# Altium schematic sheet 06 - MCU.SchDoc
size 420 x 297 mm
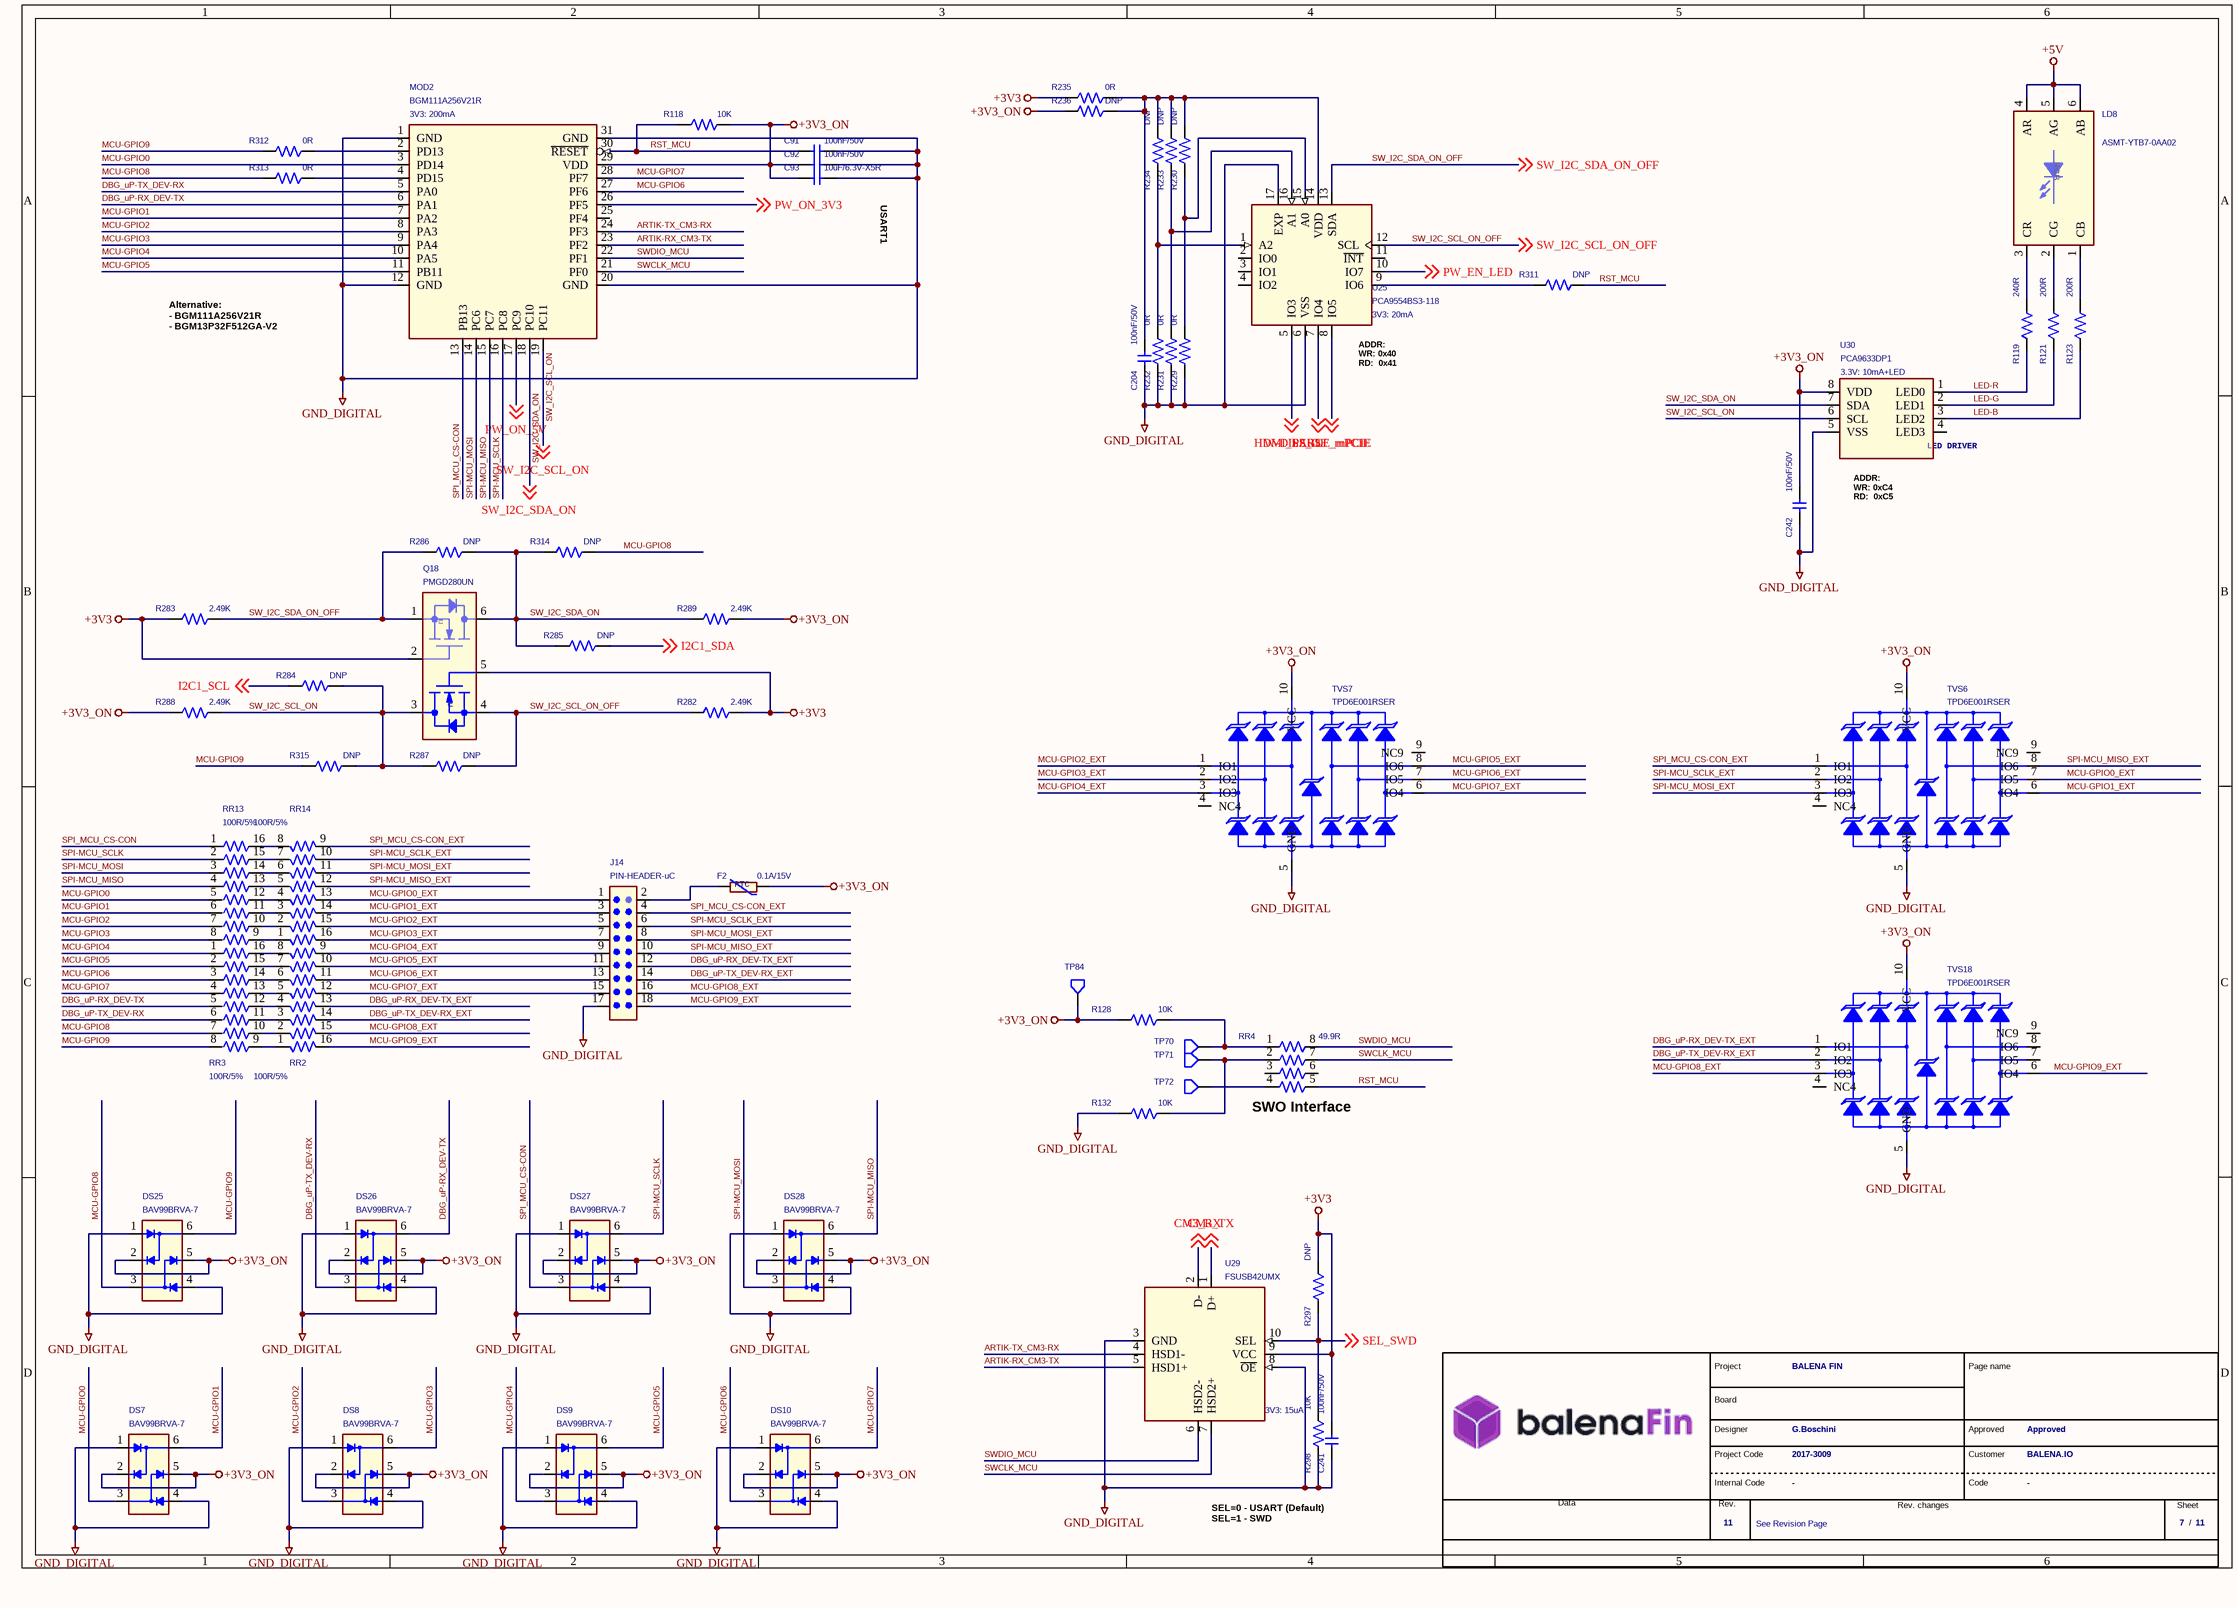
[diagram p0: 06 - MCU.SchDoc]

## Parts
*  Revision: 11  FAE RD code: 2017-3009  DocumentoRev: See Revision Page  Page Number: 7  Nome Progetto: BALENA FIN  Customer name: BALENA.IO  Project manager: Approved  Project designer: G.Boschini  (hidden comment: MyFAEVuoto)  (graphical)
C91  100nF/50V  [CS-C-0402]
C92  100nF/50V  [CS-C-0402]
C93  10uF/6.3V-X5R  [CS-C-0402]
C204  100nF/50V  [CS-C-0402]
C241  100nF/50V  [CS-C-0402]
C242  100nF/50V  [CS-C-0402]
DS7  BAV99BRVA-7  [SOT563]
DS8  BAV99BRVA-7  [SOT563]
DS9  BAV99BRVA-7  [SOT563]
DS10  BAV99BRVA-7  [SOT563]
DS25  BAV99BRVA-7  [SOT563]
DS26  BAV99BRVA-7  [SOT563]
DS27  BAV99BRVA-7  [SOT563]
DS28  BAV99BRVA-7  [SOT563]
F2  0.1A/15V  [FS-0603]
J14  PIN-HEADER-uC  [J-9X2-0254-MDT]
LD8  ASMT-YTB7-0AA02  [LD-PLCC6-GUIDAVLP]
MOD2  BGM111A256V21R  Power requirements: 3V3: 200mA  [MOD-ARTIK-020]
Q18  PMGD280UN  [SOT363]
R118  10K  [RS-0402]
R119  240R  [RS-0402]
R121  200R  [RS-0402]
R123  200R  [RS-0402]
R128  10K  [RS-0402]
R132  10K  [RS-0402]
R229  0R  [RS-0402]
R230  DNP  [RS-0402]
R231  0R  [RS-0402]
R232  0R  [RS-0402]
R233  DNP  [RS-0402]
R234  DNP  [RS-0402]
R235  0R  [RS-0402]
R236  DNP  [RS-0402]
R282  2.49K  [RS-0402]
R283  2.49K  [RS-0402]
R284  DNP  [RS-0402]
R285  DNP  [RS-0402]
R286  DNP  [RS-0402]
R287  DNP  [RS-0402]
R288  2.49K  [RS-0402]
R289  2.49K  [RS-0402]
R297  DNP  [RS-0402]
R298  10K  [RS-0402]
R311  DNP  [RS-0402]
R312  0R  [RS-0402]
R313  0R  [RS-0402]
R314  DNP  [RS-0402]
R315  DNP  [RS-0402]
RR2  100R/5%  [RR-8X-1506]
RR3  100R/5%  [RR-8X-1506]
RR4  49.9R  [RR-1206]
RR13  100R/5%  [RR-8X-1506]
RR14  100R/5%  [RR-8X-1506]
TP70  TPS  [TPS-0100]  (value not drawn)  (no BOM)
TP71  TPS  [TPS-0100]  (value not drawn)  (no BOM)
TP72  TPS  [TPS-0100]  (value not drawn)  (no BOM)
TP84  TPS  [TPS-0100]  (value not drawn)  (no BOM)
TVS6  TPD6E001RSER  [UFQFN10]
TVS7  TPD6E001RSER  [UFQFN10]
TVS18  TPD6E001RSER  [UFQFN10]
U25  PCA9554BS3-118  Power requirements: 3V3: 20mA  [QFN16-EXP-3X3-4X4]
U29  FSUSB42UMX  Power requirements: 3V3: 15uA  [UMLP10]
U30  PCA9633DP1  Power requirements: 3.3V: 10mA+LED  [MSOP8]

## Nets
+3V3: C241.1 Q18.2(G1) Q18.5(G2) R235.2 R282.1 R283.2 R297.2 U29.9(VCC)
+3V3_ON: C92.1 C93.1 C242.1 DS7.2(C1) DS7.5(C2) DS8.2(C1) DS8.5(C2) DS9.2(C1) DS9.5(C2) DS10.2(C1) DS10.5(C2) DS25.2(C1) DS25.5(C2) DS26.2(C1) DS26.5(C2) DS27.2(C1) DS27.5(C2) DS28.2(C1) DS28.5(C2) F2.2 MOD2.29(VDD) R118.2 R128.2 R236.2 R288.2 R289.1 TP84.1(TP) TVS6.10(VCC) TVS7.10(VCC) TVS18.10(VCC) U30.8(VDD)
+5V: LD8.4(AR) LD8.5(AG) LD8.6(AB)
GND_DIGITAL: C91.2 C92.2 C93.2 C204.2 C241.2 C242.2 DS7.1(A1) DS7.4(A2) DS8.1(A1) DS8.4(A2) DS9.1(A1) DS9.4(A2) DS10.1(A1) DS10.4(A2) DS25.1(A1) DS25.4(A2) DS26.1(A1) DS26.4(A2) DS27.1(A1) DS27.4(A2) DS28.1(A1) DS28.4(A2) J14.17 MOD2.1(GND) MOD2.12(GND) MOD2.20(GND) MOD2.31(GND) R132.2 R229.1 R231.1 R232.1 R298.1 TVS6.5(GND) TVS7.5(GND) TVS18.5(GND) U25.6(VSS) U25.17(EXP) U29.3(GND) U29.8(~{OE}) U30.5(VSS)
ARTIK-RX_CM3-TX: MOD2.23(PF2) U29.5(HSD1+)
ARTIK-TX_CM3-RX: MOD2.24(PF3) U29.4(HSD1-)
CM3_RX: U29.2(D-) ; off-sheet CM3_RX
CM3_TX: U29.1(D+) ; off-sheet CM3_TX
DBG_uP-RX_DEV-TX: DS26.6(AC1) MOD2.6(PA1) RR3.5
DBG_uP-RX_DEV-TX_EXT: J14.12 RR2.13 TVS18.1(IO1)
DBG_uP-TX_DEV-RX: DS26.3(AC2) MOD2.5(PA0) RR3.6
DBG_uP-TX_DEV-RX_EXT: J14.14 RR2.14 TVS18.2(IO2)
HDMI_LS_OE: U25.5(IO3) ; off-sheet HDMI_LS_OE
I2C1_SCL: R284.2 ; off-sheet I2C1_SCL
I2C1_SDA: R285.1 ; off-sheet I2C1_SDA
LED-B: R123.2 U30.3(LED2)
LED-G: R121.2 U30.2(LED1)
LED-R: R119.2 U30.1(LED0)
MCU-GPIO0: DS7.3(AC2) MOD2.3(PD14) RR13.5
MCU-GPIO0_EXT: J14.1 RR14.13 TVS6.7(IO5)
MCU-GPIO1: DS7.6(AC1) MOD2.7(PA2) RR13.6
MCU-GPIO1_EXT: J14.3 RR14.14 TVS6.6(IO4)
MCU-GPIO2: DS8.3(AC2) MOD2.8(PA3) RR13.7
MCU-GPIO2_EXT: J14.5 RR14.15 TVS7.1(IO1)
MCU-GPIO3: DS8.6(AC1) MOD2.9(PA4) RR13.8
MCU-GPIO3_EXT: J14.7 RR14.16 TVS7.2(IO2)
MCU-GPIO4: DS9.3(AC2) MOD2.10(PA5) RR3.1
MCU-GPIO4_EXT: J14.9 RR2.9 TVS7.3(IO3)
MCU-GPIO5: DS9.6(AC1) MOD2.11(PB11) RR3.2
MCU-GPIO5_EXT: J14.11 RR2.10 TVS7.8(IO6)
MCU-GPIO6: DS10.3(AC2) MOD2.27(PF6) RR3.3
MCU-GPIO6_EXT: J14.13 RR2.11 TVS7.7(IO5)
MCU-GPIO7: DS10.6(AC1) MOD2.28(PF7) RR3.4
MCU-GPIO7_EXT: J14.15 RR2.12 TVS7.6(IO4)
MCU-GPIO8: DS25.3(AC2) R313.2 R314.1 RR3.7
MCU-GPIO8_EXT: J14.16 RR2.15 TVS18.3(IO3)
MCU-GPIO9: DS25.6(AC1) R312.2 R315.2 RR3.8
MCU-GPIO9_EXT: J14.18 RR2.16 TVS18.6(IO4)
PERST_mPCIE: U25.8(IO5) ; off-sheet PERST_mPCIE
PW_EN_LED: U25.10(IO7) ; off-sheet PW_EN_LED
PW_ON_3V3: MOD2.26(PF5) ; off-sheet PW_ON_3V3
PW_ON_5V: MOD2.17(PC9) ; off-sheet PW_ON_5V
RST_MCU: C91.1 MOD2.30(~{RESET}) R118.1 R311.1 RR4.5
SEL_SWD: R297.1 R298.2 U29.10(SEL) ; off-sheet SEL_SWD
SPI-MCU_MISO: DS28.6(AC1) MOD2.15(PC7) RR13.4
SPI-MCU_MISO_EXT: J14.10 RR14.12 TVS6.8(IO6)
SPI-MCU_MOSI: DS28.3(AC2) MOD2.14(PC6) RR13.3
SPI-MCU_MOSI_EXT: J14.8 RR14.11 TVS6.3(IO3)
SPI-MCU_SCLK: DS27.6(AC1) MOD2.16(PC8) RR13.2
SPI-MCU_SCLK_EXT: J14.6 RR14.10 TVS6.2(IO2)
SPI_MCU_CS-CON: DS27.3(AC2) MOD2.13(PB13) RR13.1
SPI_MCU_CS-CON_EXT: J14.4 RR14.9 TVS6.1(IO1)
SW_I2C_SCL_ON: MOD2.19(PC11) Q18.3(D2) R284.1 R287.2 R288.1 R315.1 U30.6(SCL) ; off-sheet SW_I2C_SCL_ON
SW_I2C_SCL_ON_OFF: Q18.4(S2) R282.2 R287.1 U25.12(SCL) ; off-sheet SW_I2C_SCL_ON_OFF
SW_I2C_SDA_ON: MOD2.18(PC10) Q18.6(D1) R285.2 R286.1 R289.2 R314.2 U30.7(SDA) ; off-sheet SW_I2C_SDA_ON
SW_I2C_SDA_ON_OFF: Q18.1(S1) R283.1 R286.2 U25.13(SDA) ; off-sheet SW_I2C_SDA_ON_OFF
SWCLK_MCU: MOD2.21(PF0) RR4.7 U29.7(HSD2+)
SWDIO_MCU: MOD2.22(PF1) RR4.8 U29.6(HSD2-)
W-DISABLE_mPCIE: U25.7(IO4) ; off-sheet W-DISABLE_mPCIE
NetC204_1: C204.1 R230.2 R233.2 R234.2 R235.1 R236.1 U25.14(VDD)
NetF2_1: F2.1 J14.2
NetLD8_1: LD8.1(CB) R123.1
NetLD8_2: LD8.2(CG) R121.1
NetLD8_3: LD8.3(CR) R119.1
NetMOD2_2: MOD2.2(PD13) R312.1
NetMOD2_4: MOD2.4(PD15) R313.1
NetR128_1: R128.1 RR4.1 TP70.1(TP)
NetR132_1: R132.1 RR4.2 TP71.1(TP)
NetR229_2: R229.2 R230.1 U25.15(A0)
NetR231_2: R231.2 R233.1 U25.16(A1)
NetR232_2: R232.2 R234.1 U25.1(A2)
NetR311_2: R311.2 U25.9(IO6)
NetRR2_1: RR2.1 RR3.9
NetRR2_2: RR2.2 RR3.10
NetRR2_3: RR2.3 RR3.11
NetRR2_4: RR2.4 RR3.12
NetRR2_5: RR2.5 RR3.13
NetRR2_6: RR2.6 RR3.14
NetRR2_7: RR2.7 RR3.15
NetRR2_8: RR2.8 RR3.16
NetRR4_4: RR4.4 TP72.1(TP)
NetRR13_9: RR13.9 RR14.1
NetRR13_10: RR13.10 RR14.2
NetRR13_11: RR13.11 RR14.3
NetRR13_12: RR13.12 RR14.4
NetRR13_13: RR13.13 RR14.5
NetRR13_14: RR13.14 RR14.6
NetRR13_15: RR13.15 RR14.7
NetRR13_16: RR13.16 RR14.8

Not connected (* = marked no-connect by the designer): MOD2 25(PF4); RR4 3 6; TVS6 4(NC4) 9(NC9); TVS7 4(NC4) 9(NC9); TVS18 4(NC4) 7(IO5) 8(IO6) 9(NC9); U25 2(IO0) 3(IO1) 4(IO2) 11(~{INT}); U30 4(LED3)

## Notes on the sheet
- USART1
- Alternative:
  - BGM111A256V21R
  - BGM13P32F512GA-V2
- (near U25) ADDR:
  WR: 0x40
  RD:  0x41
- ADDR:
  WR: 0xC4
  RD:  0xC5
- (near RR4) SWO Interface
- SEL=0 - USART (Default)
  SEL=1 - SWD
- (in symbol LED DRIVER-4x - PCA9633DP1) LED DRIVER
- (in symbol LED RGB - ASMT-YTB7-0AA02) RGB
- (in symbol MyFAEVuoto) Project; Page name; Board; Designer; Project Code; Customer; Internal Code; Code; Data; Rev.; Rev. changes; Sheet; /
- (in symbol NMOS-2X - PMGD280UN - 0.87A/20V) n
- (in symbol PTC - 0ZCM0010FF2G - 0.1A/15V) PTC

## Library data of the parts
C91 C92 = CS-C-0402-100n/16V: CHIP CAP.CER. 100nF 16V 10% X7R 0402; MPN: Generic; Alternative MPN: C0402C104K4RACTU; Room: ARTIK 020; Pkg Type: SMD; Mount: Yes
C93 = CS-C-0402-10u/6V3-X5R: CHIP CAP.CER. 10uF 6.3V 20% X5R 0402; MPN: Generic; Alternative MPN: CC0402MRX5R5BB106; Pkg Type: SMD; Room: ARTIK 020; Temperature range: -55°..+85°; Mount: Yes
C204 = CS-C-0402-100n/16V: CHIP CAP.CER. 100nF 16V 10% X7R 0402; MPN: Generic; Alternative MPN: C0402C104K4RACTU; Room: IO-EXPANDER; Pkg Type: SMD; Mount: Yes
C241 = CS-C-0402-100n/16V: CHIP CAP.CER. 100nF 16V 10% X7R 0402; MPN: Generic; Alternative MPN: C0402C104K4RACTU; Room: SWITCH USB; Pkg Type: SMD; Mount: Yes
C242 = CS-C-0402-100n/16V: CHIP CAP.CER. 100nF 16V 10% X7R 0402; MPN: Generic; Alternative MPN: C0402C104K4RACTU; Room: SWITCH-PW-3V3; Pkg Type: SMD; Mount: Yes
DS7-DS10 DS25-DS28 = DIODO4x - BAV99BRVA-7 -0.2A/75V: Diode Switching 75V 0.215A 6-Pin SOT-563 T/R; Room: MCU CONNECTOR; Note: 2x Serie; Pkg Type: SMD; Temperature range: -65°..+150°; MPN: BAV99BRVA-7; Mount: Yes
F2 = PTC - 0ZCM0010FF2G - 0.1A/15V: PTC RESET FUSE 15V 100MA 0603; Pkg Type: SMD; Note: Ihold=250mA; Room: MCU CONNECTOR; Temperature range: -40°..+85°; MPN: 0ZCM0010FF2G; Mount: Yes
J14 = STRIP-J-9X2-0254-MDT: CONN HEADER THT 18POS 2.54MM DUAL ROW; MPN: Generic; Room: MCU CONNECTOR; Pkg Type: THT; Mount: Yes
LD8 = LED RGB - ASMT-YTB7-0AA02: LED RGB- 623nm Red, 529nm Green, PLCC6 469nm Blue LED Indication -  Discrete 2.1V Red, 3.1V; Room: LED RGB; Note: VFR=2.1V@20mA - VFG=VFB=3.1V@20mA; Pkg Type: SMD; MPN: ASMT-YTB7-0AA02; Mount: Yes
MOD2 = ARTIK - 020: Bluetooth v4.2 Transceiver Module 2.4GHz Integrated, Chip Surface Mount; Note: PU_GPIO=100k - VIH=VDDx0.7 - VIL=VDDx0.3 - VOH=VDDx0.6 - VOL=VDDx0.4; Pkg Type: SMD; Room: ARTIK 020; Temperature range: -40°..+85°; MPN: BGM111A256V21R; Mount: Yes
Q18 = NMOS-2X - PMGD280UN - 0.87A/20V: MOSFET 2N-CH 20V 0.87A 6TSSOP; Pkg Type: SMD; Note: Vth=0.7V - Rds=0.4ohm; Room: I2C-ISOLATOR; Temperature range: -55°..+150°; MPN: PMGD280UN; Mount: Yes
R118 = RS-0402-10k: CHIP RES. 10K 0402 1/16W 1%; MPN: Generic; Room: ARTIK 020; Pkg Type: SMD; Temperature range: -55°..+125°; Mount: Yes
R119 = RS-0402-240r: CHIP RES. 240R 0402 1/16W 1% 100PPM/°C; MPN: Generic; Pkg Type: SMD; Note: 100ppm; Room: LED RGB; Temperature range: -55°..+125°; Mount: Yes
R121 R123 = RS-0402-200r: CHIP RES. 200R 0402 1/16W 1% 100PPM/°C; MPN: Generic; Pkg Type: SMD; Note: 100ppm; Room: LED RGB; Mount: Yes
R128 R132 = RS-0402-10k: CHIP RES. 10K 0402 1/16W 1%; MPN: Generic; Room: SWO MCU; Pkg Type: SMD; Temperature range: -55°..+125°; Mount: Yes
R229 R231 R232 R235 R312 R313 = RS-0402-0r: CHIP RES. 0R 0402 1/16W 1%; MPN: Generic; Room: IO-EXPANDER; Pkg Type: SMD; Mount: Yes
R230 R233 R234 R236 = RS-0402: CHIP RES. 0402; MPN: Generic; Pkg Type: SMD; Room: IO-EXPANDER; Mount: No
R282 R283 R288 R289 = RS-0402-2.49k: CHIP RES. 2K49 0402 1/16W 1% 100PPM/°C; MPN: Generic; Room: I2C-ISOLATOR; Note: 100ppm; Pkg Type: SMD; Mount: Yes
R284 R285 R314 R315 = RS-0402: CHIP RES. 0402; MPN: Generic; Pkg Type: SMD; Room: I2C-ISOLATOR; Mount: No
R286 R287 = RS-0402: CHIP RES. 0R 0402 1/10W 1%; MPN: Generic; Pkg Type: SMD; Room: I2C-ISOLATOR; Mount: No
R297 = RS-0402: CHIP RES. 0402; MPN: Generic; Pkg Type: SMD; Mount: No
R298 = RS-0402-10k: CHIP RES. 10K 0402 1/16W 1%; MPN: Generic; Pkg Type: SMD; Temperature range: -55°..+125°; Mount: Yes
R311 = RS-0402-0r: CHIP RES. 0R 0402 1/16W 1%; MPN: Generic; Room: I2C-ISOLATOR; Pkg Type: SMD; Mount: No
RR2 RR3 RR13 RR14 = RR-8X-1506-100r/5%: RES ARRAY 8 RES 100 OHM 1506 5%; MPN: Generic; Alternative MPN: CAY16-101J8LF; Room: MCU CONNECTOR; Note: 200ppm; Pkg Type: SMD; Temperature range: -55°..+125°; Mount: Yes
RR4 = RR-1206-49.9r: RES ARRAY 4 RES 49.9 OHM 1206 1%; MPN: Generic; Alternative MPN: CAY16-49R9F4LF; Note: 4x; Pkg Type: SMD; Room: SWO MCU; Mount: Yes
TP70-TP72 TP84 = TEST POINT SMD 1 MM: TEST POINT SMD; MPN: TP-No-BoM; Pkg Type: SMD; Mount: Yes
TVS6 TVS7 TVS18 = TVS-UNI6x - TPD6E001RSER: TVS DIODE 5VWM; Room: MCU CONNECTOR; Pkg Type: SMD; Note: Unidirectional - 6x - High-Speed Data Interface  I/O; Temperature range: -40°..+85°; MPN: TPD6E001RSER; Mount: Yes
U25 = IO EXP-8b - PCA9554BS3-118: IC I/O EXPANDER I2C 8B 16HVQFN; Alternative MPN: PCA9554ABS; Room: IO-EXPANDER; Note: Full Bidirectional; Pkg Type: SMD; Temperature range: -40°..+85°; MPN: PCA9554BS3-118; Mount: Yes
U29 = SWITCH-USB - FSUSB42UMX: USB Switch IC 1 Channel 10-UMLP (1.8x1.4); Room: SWITCH USB; Pkg Type: SMD; Temperature range: -40°..+85°; MPN: FSUSB42UMX; Mount: Yes
U30 = LED DRIVER-4x - PCA9633DP1: IC LED DRIVER PS DIM 25MA 8TSSOP; Note: VCC=2.3V-5.5V - VIH-I2C=0.7*VDD-5.5V; Pkg Type: SMD; Temperature range: -40°..+85°; MPN: PCA9633DP1; Mount: Yes
* = MyFAEVuoto: Page Count: 11; Customer Code: -; Database: -